# Altium schematic sheet SD_CARD.SchDoc: SD Card
size B; CheckedBy: Lance Bantoto; Engineer: Cindy Li; Organization: Altium Limited; Address1: L3, 12a Rodborough Rd; Address2: Frenchs Forest; Address3: NSW; Address4: Australia 2086; Revision: 1; SheetNumber: 6; SheetTotal: 6
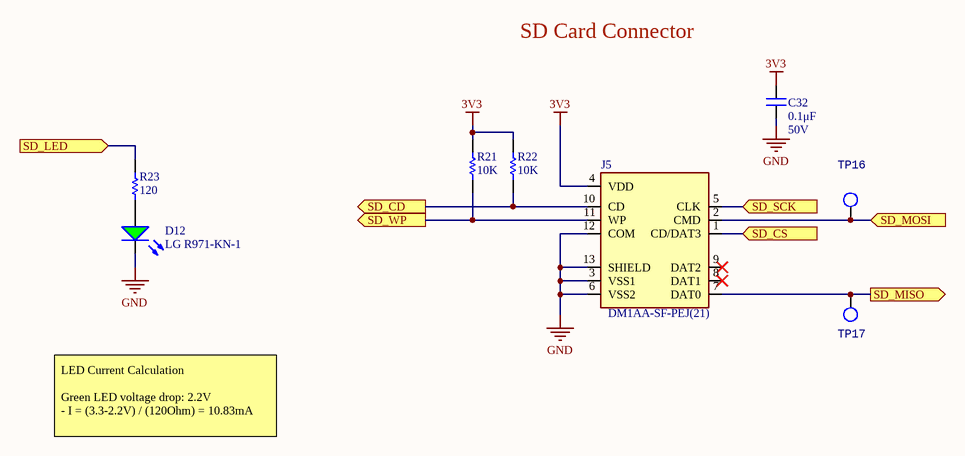
[diagram p0: SD_CARD.SchDoc]

## Parts
C32  value 0.1μF  Voltage Rating: 50V  [CAP2012]  (hidden comment: CAP_0.1uF_50V_0805)
D12  LG R971-KN-1  [LED_0805_GREEN]
J5  Manufacturer Part Number 1: DM1AA-SF-PEJ(21)  [HRS_DM1AA-SF-PEJ(21)]  (hidden comment: SD_CARD_CON)
R21  value 10K  [RESC0603(1608)_N]  (hidden comment: RES_10K_0603)
R22  value 10K  [RESC0603(1608)_N]  (hidden comment: RES_10K_0603)
R23  value 120  [RESC0603(1608)_N]  (hidden comment: RES_120R_0603)
TP16  TESTPOINT_LOOP  [TESTPOINT_LOOP]  (value not drawn)
TP17  TESTPOINT_LOOP  [TESTPOINT_LOOP]  (value not drawn)

## Ports
SD_CD (out), SD_CS (in), SD_LED (in), SD_MISO (out), SD_MOSI (in), SD_SCK (in), SD_WP (out)

## Nets
3V3: C32.2 J5.4(VDD) R21.2 R22.2
GND: C32.1 D12.2(K) J5.3(VSS1) J5.6(VSS2) J5.12(COM) J5.13(SHIELD)
SD_CD: J5.10(CD) R22.1 ; port SD_CD
SD_CS: J5.1(CD/DAT3) ; port SD_CS
SD_LED: R23.1 ; port SD_LED
SD_MISO: J5.7(DAT0) TP17.1 ; port SD_MISO
SD_MOSI: J5.2(CMD) TP16.1 ; port SD_MOSI
SD_SCK: J5.5(CLK) ; port SD_SCK
SD_WP: J5.11(WP) R21.1 ; port SD_WP
NetD12_1: D12.1(A) R23.2

Not connected (* = marked no-connect by the designer): J5 8(DAT1)* 9(DAT2)*

## Notes on the sheet
- SD Card Connector
- LED Current Calculation
  Green LED voltage drop: 2.2V
  - I = (3.3-2.2V) / (120Ohm) = 10.83mA
- Title:
- Project:
- Date:
- Rev:
- Checker:
- Engineer:
- Sheet:
- of

## Library data of the parts
C32 = CAP_0.1uF_50V_0805: CAP CER 0.1UF 50V X7R 0805; Manufacturer 1: Murata Electronics; Manufacturer Part Number 1: GCD21BR71H104KA01L; Tolerance: 10%; Mount: Surface Mount; Case Code (Metric): 2012; Case Code (Imperial): 0805; Min Operating Temperature: -55°C; Max Operating Temperature: 125°C; Dielectric: X7R; Termination: SMD/SMT; Length: 2mm; Height: 1.25mm; Width: 0.049inch; Thickness: 0.049inch; Depth: 1.25mm; Ratings: AEC-Q200; Supplier 1: Digi-Key; Supplier Part Number 1: 490-11955-1-ND; Package: 0805 (2012 Metric)
D12 = DIO_LED_G: LED GREEN DIFFUSED 0805 SMD; Manufacturer 1: OSRAM; Forward Voltage Drop: 2.2V; Package: 0805 (2012 Metric); Supplier Part Number 1: 475-1410-1-ND; Supplier 1: Digi-Key; Manufacturer Part Number 1: LG R971-KN-1; Mount: Surface Mount
J5 = SD_CARD_CON: CONN SD CARD PUSH-PUSH R/A SMD; Manufacturer 1: Hirose Electric Co Ltd; Supplier 1: Digi-Key; Supplier Part Number 1: HR845CT-ND; Mount: Surface Mount; Card Type: SD
R21 R22 = RES_10K_0603: RES SMD 10K OHM 5% 1/10W 0603; Manufacturer 1: Yageo; Manufacturer Part Number 1: RC0603JR-0710KL; Package: 0603 (1608 Metric); Dimensions: 0.063" L x 0.031" W (1.60mm x 0.80mm); Tolerance: 5%; Supplier Part Number 1: 311-10KGRCT-ND; Supplier 1: Digi-Key; Mount: Surface Mount
R23 = RES_120R_0603: RES SMD 120 OHM 5% 1/10W 0603; Manufacturer 1: Yageo; Manufacturer Part Number 1: RC0603JR-07120RL; Package: 0603 (1608 Metric); Dimensions: 0.063" L x 0.031" W (1.60mm x 0.80mm); Tolerance: 5%; Supplier Part Number 1: 311-120GRCT-ND; Supplier 1: Digi-Key; Mount: Surface Mount
TP16 TP17 = TESTPOINT_LOOP: PC TEST POINT MINIATURE WHITE; Manufacturer Part Number 1: 5002; Manufacturer 1: Keystone Electronics; Supplier Part Number 1: 36-5002-ND; Supplier 1: Digi-Key; Mount: Through Hole